# Altium schematic sheet Sheet1.SchDoc: Test
size Letter; SheetNumber: 1; SheetTotal: 1; Project: USB Oscope; ENG_APP_DATE: --/--/--; DSN_APP_DATE: --/--/--; CHK_APP_DATE: --/--/--
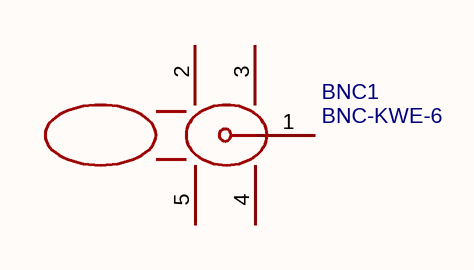
[diagram p0: Sheet1.SchDoc]

## Parts
BNC1  BNC-KWE-6  [CONN-TH_BNC-KWE-6]

## Nets

Not connected (* = marked no-connect by the designer): BNC1 1 2 3 4 5

## Notes on the sheet
- THIS DOCUMENT AND THE DATA DISCLOSED HEREIN OR
- HEREWITH IS THE PROPERTY OF ALTIUM LIMITED AND MAY
- DWG NO:
- REVISION
- REV:
- DESCRIPTION
- DATE
- APPROVED
- BE FREELY DISTRIBUTED IN WHOLE. NO RIGHTS ARE
- RESERVED OR EXPRESS OR IMPLIED WARANTEE GIVEN.
- ENG:
- APPROVALS
- PROJECT
- DSN:
- CHK:
- REFERENCE DOCUMENTS
- PROJECT REVISION:
- TITLE
- DOCUMENT REVISION:
- DESIGN ITEM:
- BOM:
- FAB DWG:
- PCB DWG:
- ASSY DWG:
- SCALE:
- A3
- SIZE
- CAGE CODE
- FILE NAME
- DWG NO.
- SHEET
- OF
- REV

## Library data of the parts
BNC1 = CMP-004-000000-3: Connector Type:Board Side Interface:Inner Bore Number of Ports:1 Interface Length/Height:12mm Frequency:6GHz RF Series:BNC Impedance:50Ω Style:Bent tip; Manufacturer: cntitle(中戈泰斗); Number of Ports: 1; Value: 6GHz; 3D Model Transform: 531.016,1338.97378,0,0,0,0,0,-470.511,-149.606; Impedance: 50Ω; 3D Model: 1ee7285c1b8f4c589de2df097266f005聨0819f05c4eef4c71ace90d822a990e87; AddInBom: yes; RF Series: BNC; Interface Length/Height: 12mm; Source: P1.SCHLIB; Symbol: BNC-KWE-6; LCSC Part Name: 内孔 BNC 弯头; Style: Bent tip; Interface: Inner Bore; Manufacturer Part: BNC-KWE-6; Connector Type: Board Side; Supplier Part: C20415789; FootprintName: CONN-TH_BNC-KWE-6; Datasheet: https://item.szlcsc.com/datasheet/BNC-KWE-6/21743971.html; Device: BNC-KWE-6; ModelName: CONN-TH_BNC-KWE-6; Supplier Footprint: 弯插; ConvertToPcb: yes; JLCPCB Part Class: Extended Part; Design Item ID: BNC-KWE-6